# EAGLE design L293 (EAGLE 7.2.0)
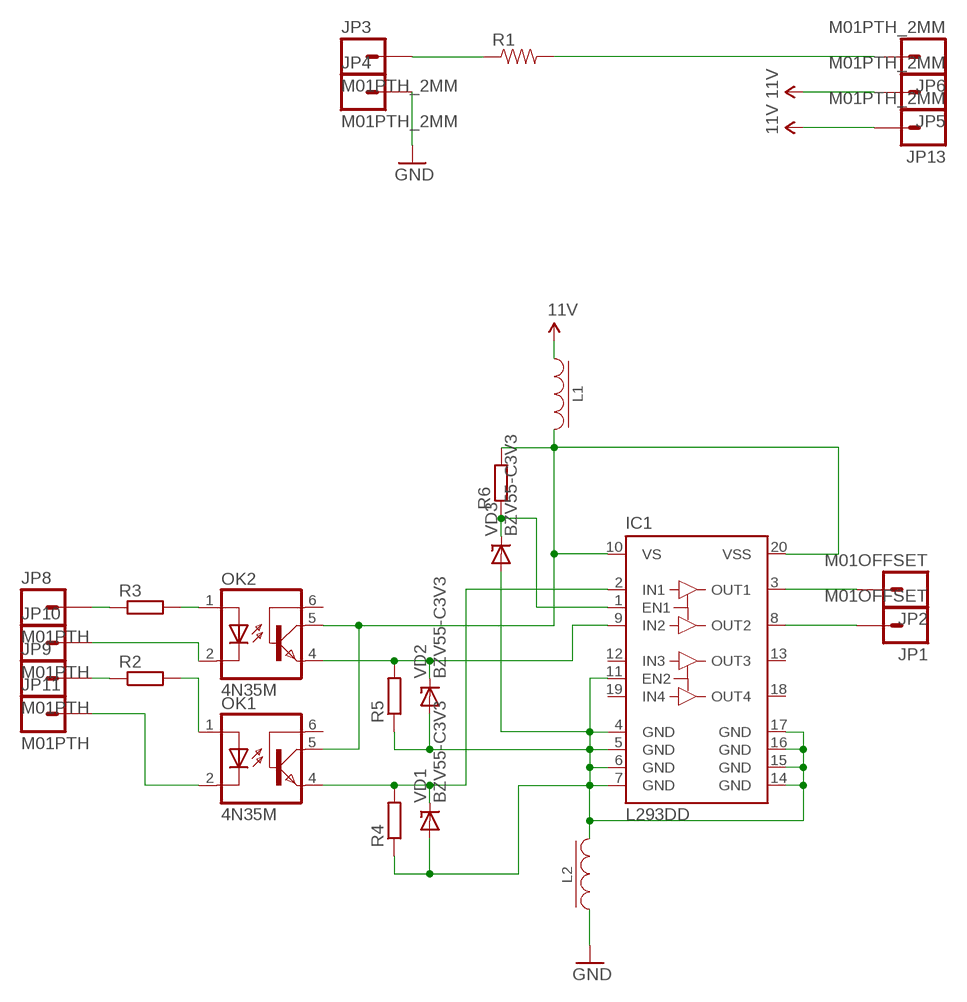
[diagram p0: schematic, sheet 1]

## Parts
IC1  L293DD  [SO20]
JP1  M01OFFSET  [1X01_OFFSET]
JP2  M01OFFSET  [1X01_OFFSET]
JP3  M01PTH_2MM  [1X01_2MM]
JP4  M01PTH_2MM  [1X01_2MM]
JP5  M01PTH_2MM  [1X01_2MM]
JP6  M01PTH_2MM  [1X01_2MM]
JP8  M01PTH  [1X01]
JP9  M01PTH  [1X01]
JP10  M01PTH  [1X01]
JP11  M01PTH  [1X01]
JP13  M01PTH_2MM  [1X01_2MM]
L1  DRA127  [DRA127]
L2  DRA127  [DRA127]
OK1  4N35M  [DIL06]
OK2  4N35M  [DIL06]
R1  RESISTOR2512  [R2512]
R2  RESISTOR0805  [0805]
R3  RESISTOR0805  [0805]
R4  RESISTOR0805  [0805]
R5  RESISTOR0805  [0805]
R6  RESISTOR0805  [0805]
VD1  BZV55-C3V3  [SOD80C]
VD2  BZV55-C3V3  [SOD80C]
VD3  BZV55-C3V3  [SOD80C]

## Nets
1.0V: JP5.1 JP13.1 L1.1 ; supply symbol labelled 11V
GND: JP4.1 L2.1
GND_DIRT: IC1.4(GND) IC1.5(GND) IC1.6(GND) IC1.7(GND) IC1.11(EN2) IC1.14(GND) IC1.15(GND) IC1.16(GND) IC1.17(GND) L2.2 R4.1 R5.1 VD1.A VD2.A VD3.A
N$3: IC1.8(OUT2) JP1.1
N$4: IC1.3(OUT1) JP2.1
N$5: JP3.1 R1.1
N$6: JP6.1 R1.2
N$7: JP9.1 R2.1
N$8: JP8.1 R3.1
N$9: IC1.10(VS) IC1.20(VSS) L1.2 OK1.5(COL) OK2.5(COL) R6.2
N$10: OK1.1(A) R2.2
N$11: JP11.1 OK1.2(C)
N$12: JP10.1 OK2.2(C)
N$13: OK2.1(A) R3.2
N$14: IC1.1(EN1) R6.1 VD3.C
N$15: IC1.9(IN2) OK2.4(EMI) R5.2 VD2.C
N$17: IC1.2(IN1) OK1.4(EMI) R4.2 VD1.C
Unconnected: IC1.12(IN3) IC1.13(OUT3) IC1.18(OUT4) IC1.19(IN4) OK1.6(BAS) OK2.6(BAS)

## Library data of the parts
IC1 = st-microelectronics:L293DD: PUSH-PULL FOUR CHANNEL DRIVER WITH DIODES Source: http://www.st.com/stonline/books/pdf/docs/1330.pdf; OC_FARNELL: unknown
JP1-JP6 JP8-JP11 JP13 = SparkFun-Connectors:M01: Header 1 Standard 1-pin 0.1" header. Use with straight break away headers (SKU : PRT-00116), right angle break away headers (PRT-00553), swiss pins (PRT-00743), machine pins (PRT-00117), and female headers (PRT-00115).
L1 L2 = inductor-cooper:DRA127: POWER INDUCTOR
OK1 OK2 = optocoupler:4N*?M: General Purpose 6-Pin Phototransistor Optocouplers Source: http://www.fairchildsemi.com/ds/4N/4N35-M.pdf; MPN: 4N35-M; OC_FARNELL: 1021351; OC_NEWARK: 98K9114
R1 = SparkFun:RESISTOR: Resistor Basic schematic elements and footprints for 0603, 1206, and PTH resistors.
R2-R6 = barthess:RESISTOR: Resistor Basic schematic elements and footprints for 0603, 1206, and PTH resistors.
VD1-VD3 = barthess:BZV55: DIODE high speed; PARTNO: ?

## Board
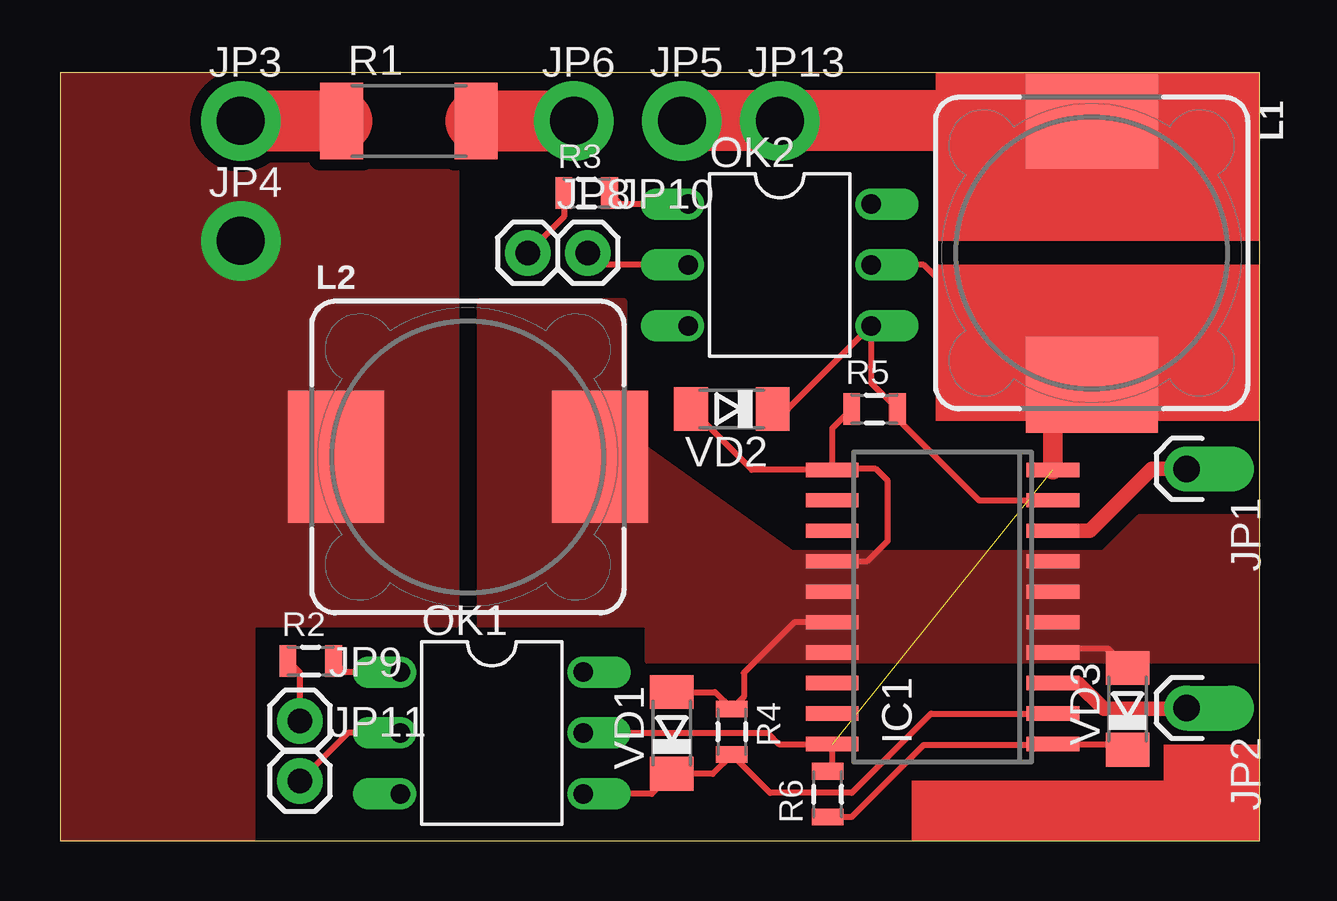
[diagram p1: board, top side]

Size 50 x 32 mm. Coordinates in mm from the lower left corner, seen from the top.
Outline: 0,0 50,0 50,32 0,32 0,0
Copper layers (1*16): Top 0.035mm / dielectric 1.5mm / Bottom 0.035mm
Design rules "default *": minimum track width 10mil, minimum drill 24mil, track to track 18mil, track to pad 18mil, pad to pad 18mil, via to via 18mil, smd to smd 18mil, copper to edge 1mil, drill to drill 8mil, minimum pad ring 10mil, minimum via ring 8mil, stop-mask expansion 4mil, vias tented up to drill 0mil, thermal gap 10mil
tRestrict: area 13,28 to 16.5,31.5

### Footprints (pad centres in the part's own frame; a part is rotated, then mirrored left to right if it is on the bottom)
SO20 = smd 0.6 x 2.2: 1 -5.715,-4.6; 2 -4.445,-4.6; 3 -3.175,-4.6; 4 -1.905,-4.6; 5 -0.635,-4.6; 6 0.635,-4.6; 7 1.905,-4.6; 8 3.175,-4.6; 9 4.445,-4.6; 10 5.715,-4.6; 11 5.715,4.6; 12 4.445,4.6; 13 3.175,4.6; 14 1.905,4.6; 15 0.635,4.6; 16 -0.635,4.6; 17 -1.905,4.6; 18 -3.175,4.6; 19 -4.445,4.6; 20 -5.715,4.6
1X01_OFFSET = drill 1.118 pad 1.88 offset: 1 0,0
1X01_2MM = drill 2 pad 3.302: 1 0,0
1X01 = drill 1.016 pad 1.88: 1 0,0
DRA127 = smd 4 x 5.5: 1 -5.5,0; 2 5.5,0
DIL06 = drill 0.813 offset: 1 -2.54,-3.81; 2 0,-3.81; 3 2.54,-3.81; 4 2.54,3.81; 5 0,3.81; 6 -2.54,3.81
R2512 = smd 1.8 x 3.2: 1 -2.8,0; 2 2.8,0
0805 = smd 0.7 x 1.3: 1 -1,0; 2 0.9,0
SOD80C = smd 1.4 x 1.8: A 1.7,0; C -1.7,0

### Placement (x,y rotation side)
IC1  36.79,9.75 90 top
JP1  46.96,15.5 270 top
JP2  46.96,5.54 270 top
JP3  7.54,30 0 top
JP4  7.54,25 0 top
JP5  25.92,30 0 top
JP6  21.42,30 0 top
JP8  19.5,24.5 0 top
JP9  10,5 0 top
JP10  22,24.5 0 top
JP11  10,2.5 0 top
JP13  30,30 0 top
L1  43,24.5 270 top
L2  17,16 0 top
OK1  18,4.5 270 top
OK2  30,24 270 top
R1  14.54,30 0 top
R2  10.5,7.5 0 top
R3  22,27 0 top
R4  28,4.5 270 top
R5  34,18 0 top
R6  32,2 90 top
VD1  25.5,4.5 90 top
VD2  28,18 180 top
VD3  44.5,5.5 90 top

### Tracks (layer width: path | path; a pad name or v marks a point on that pad's centre or on a via)
1.0V
  Top 2.54: L1.1 JP13.1 JP5.1
GND
  pour Top (no thermals): 0,32 16.5,32 16.5,9 8,9 8,0 0,0
GND_DIRT
  Top 0.254: VD3.A 43.7,8 41.5,8 | IC1.14 33.66,11.65 34.5,12.5 34.5,15 34,15.5 32.23,15.5 IC1.11 | IC1.11 32.19,17.19 R5.1 | IC1.11 28.84,15.46 VD2.A | VD1.A 27.3,6.2 R4.1 28.5,6 28.5,7 30.61,9.12 IC1.16
  Top 3.81: L2.2 22.5,15.5
  pour Top (no thermals): 24.5,9 17.5,9 17.5,22.5 23.5,22.5 23.5,17 30.5,12 43.5,12 45,13.5 50,13.5 50,7.5 24.5,7.5
N$3
  Top 0.61: IC1.8 42.92,12.93 45.5,15.5 JP1.1
N$4
  Top 0.61: IC1.3 42.42,6.58 43.5,5.5 46.92,5.5 JP2.1
N$5
  Top 2.54: JP3.1 R1.1
N$6
  Top 2.54: R1.2 JP6.1
N$7
  Top 0.254: JP9.1 10,7 R2.1
N$8
  Top 0.254: R3.1 21,26 JP8.1
N$9  (1 unrouted)
  Top 0.254: R6.2 32.19,2.9 IC1.20 29.96,4.04 29.5,4.5 OK1.5 | L1.2 38.5,19 37,20.5 37,23 36,24 OK2.5
  Top 0.813: IC1.10 41.39,17.39 L1.2
N$10
  Top 0.254: OK1.1 11.86,7.04 R2.2
N$11
  Top 0.254: OK1.2 12,4.5 JP11.1
N$12
  Top 0.254: OK2.2 22.5,24 JP10.1
N$13
  Top 0.254: OK2.1 23.36,26.54 R3.2
N$14
  Top 0.254: VD3.C 44.27,4.04 IC1.1 41.35,4 36,4 33,1 R6.1
N$15
  Top 0.254: IC1.9 38.3,14.2 34.9,17.6 R5.2 33.81,19.09 OK2.4 30.35,18 VD2.C
N$17
  Top 0.254: IC1.2 36.3,5.3 33,2 29.6,2 R4.2 27.2,2.8 VD1.C 24.66,1.96 OK1.4
(copper drawn outside any net)
  shapes: Top area x4